# Altium project First_plate_pic.PrjPcb
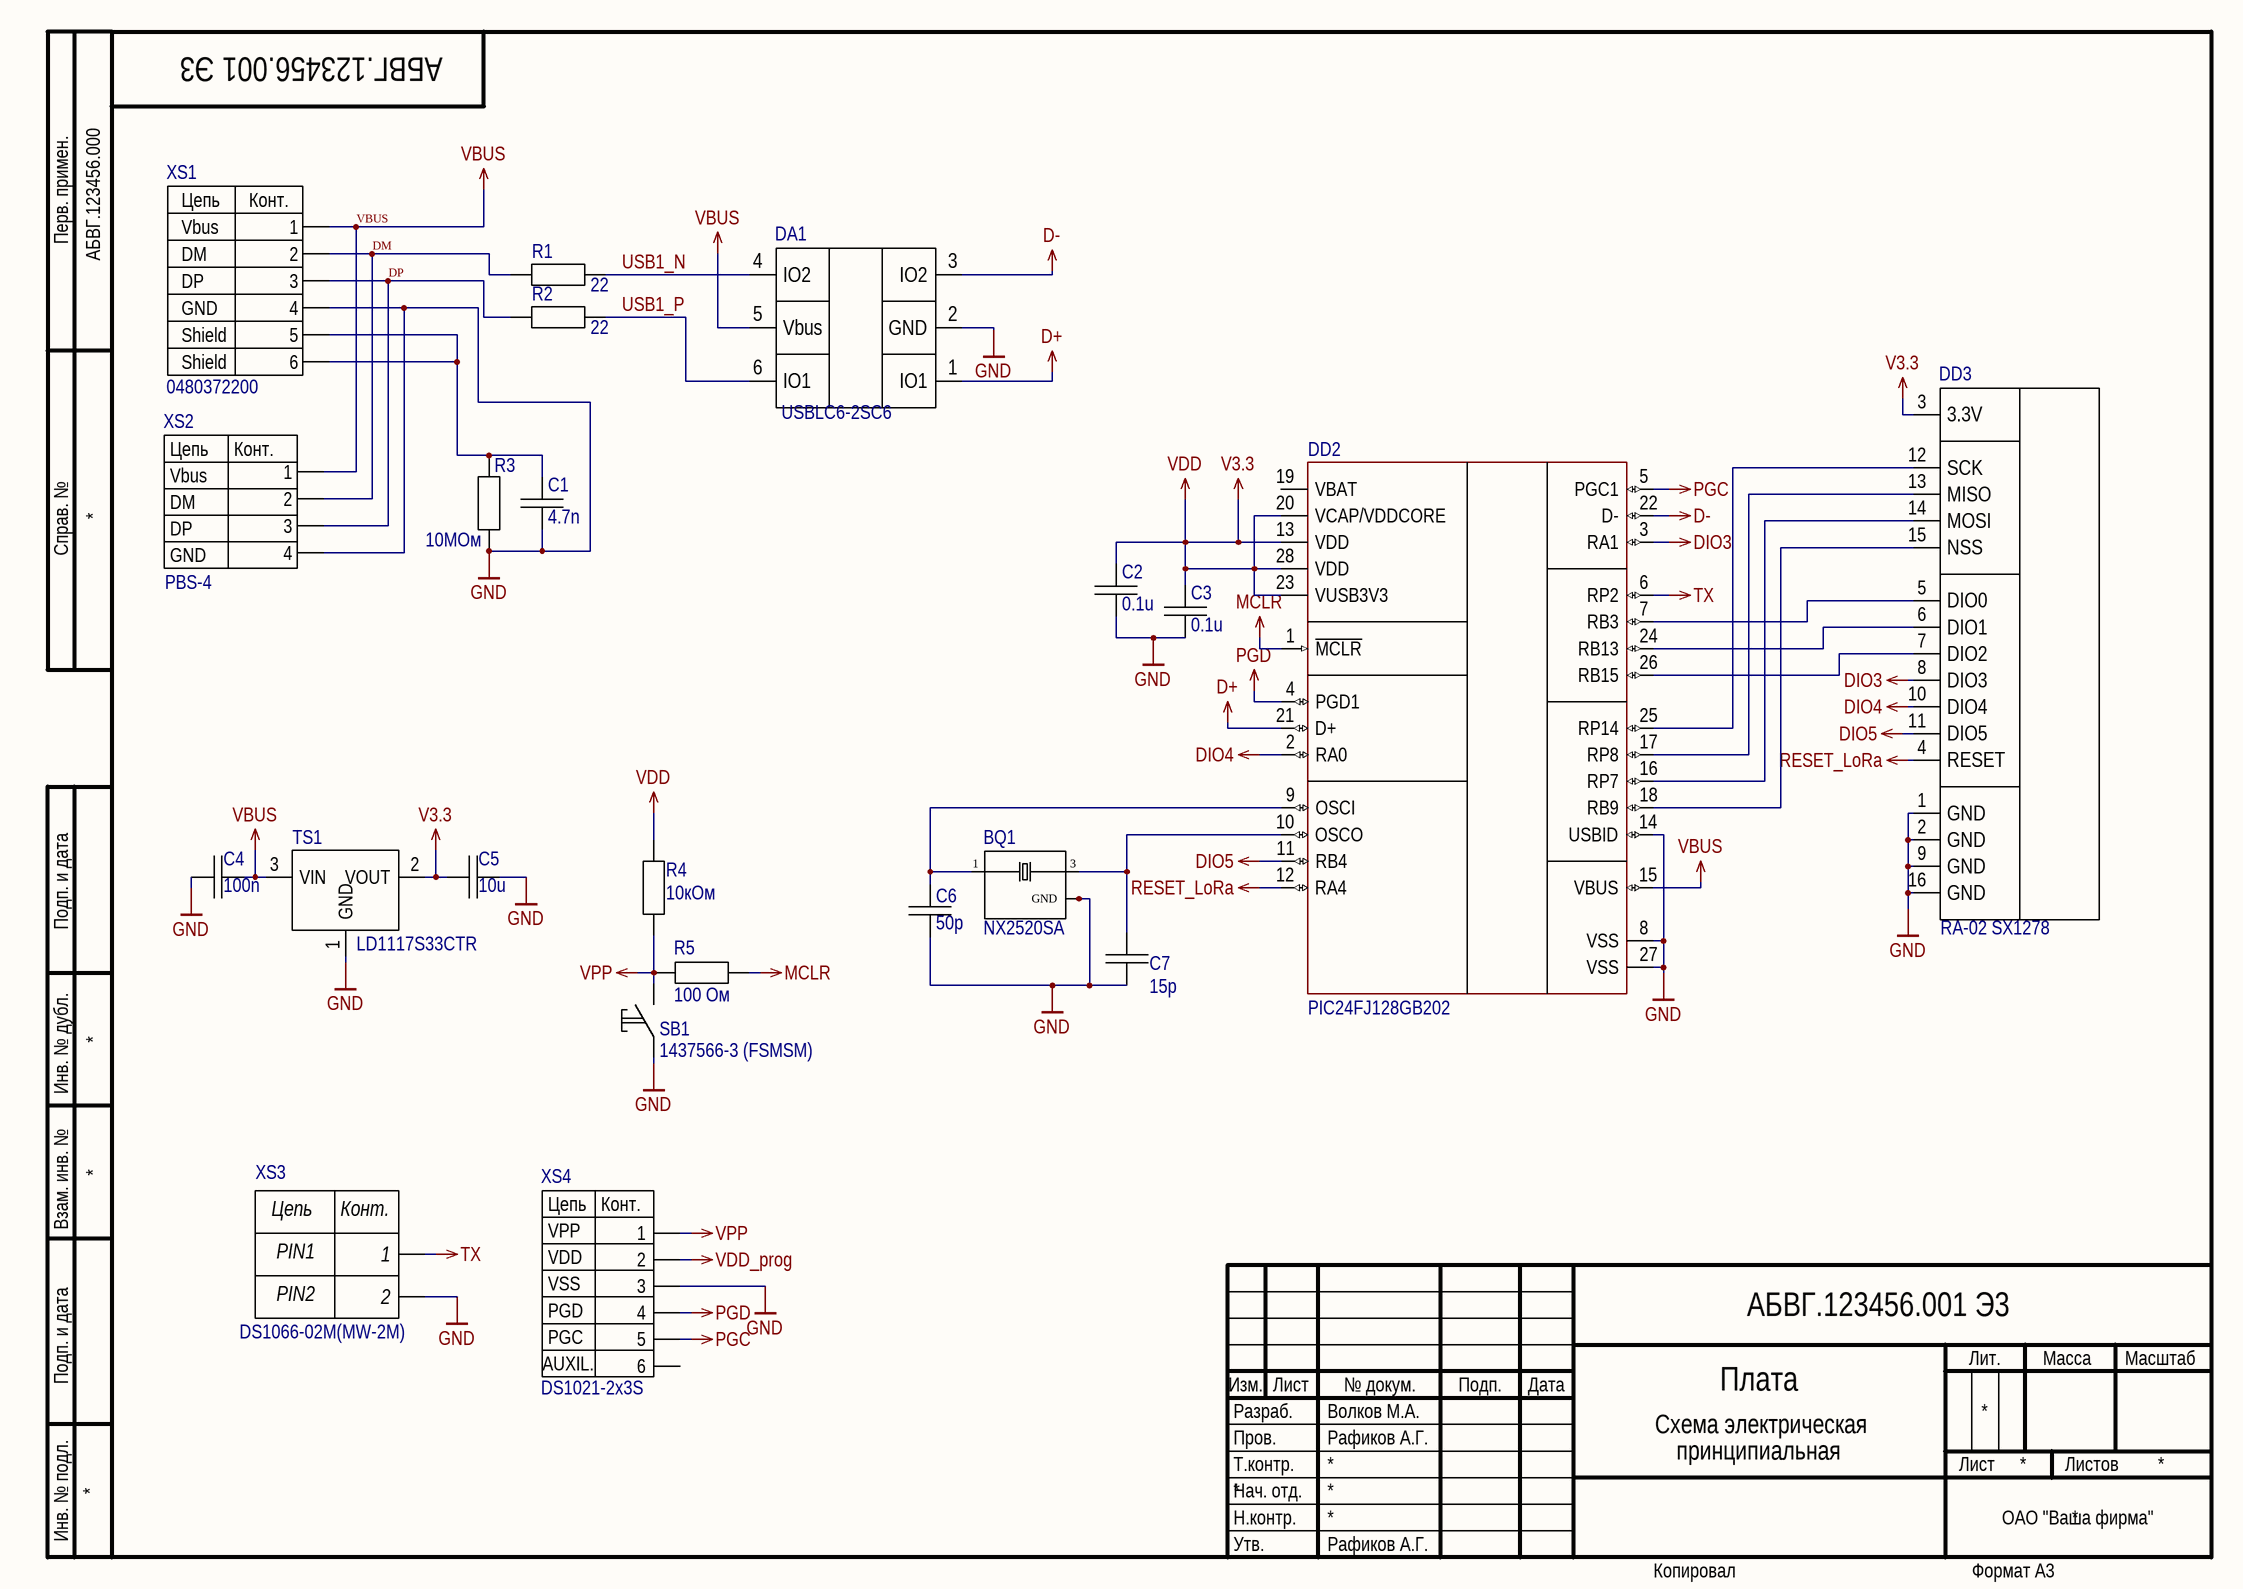
[diagram p0: LoraPic.SchDoc]
1 sheet, 22 parts. Net scope: global (net labels, ports and power ports of the same name join across sheets).
Board file: LoRaPIC1.PcbDoc

## Sheet LoraPic.SchDoc
size 420 x 297 mm; Organization: Altium Limited; Address1: L3, 12a Rodborough Rd; Address2: Frenchs Forest; Address3: NSW; Address4: Australia 2086; Scale: 1:1; Разраб.: Волков М.А.; Обозначение документа: АБВГ.123456.001 Э3; Пров.: Рафиков А.Г.; Утв.: Рафиков А.Г.; Наименование организации: ОАО "Ваша фирма"; Перв. применение: АБВГ.123456.000; Наименование изделия 1: Плата; Наименование изделия 2: Схема электрическая; Наименование изделия 3: принципиальная; Нач. отд.: Нач. отд.

### Parts
BQ1  NX2520SA  [*XTAL_NX2520SA-24.000000MHZ-B8]
C1  value 4.7n  [CAPC1608X09L]  (hidden comment: GRM1887U1H472JA01D)
C2  GRM21BR71C105KA01L: 0.1u  [CAPC1608X09L]  (hidden comment: GRM188R71H104KA93D)
C3  GRM21BR71C105KA01L: 0.1u  [CAPC1608X09L]  (hidden comment: GRM188R71H104KA93D)
C4  GRM21BR71C105KA01L: 100n  [CAPC1608X09L]  (hidden comment: GRM188R71H104KA93D)
C5  GRM21BR71C105KA01L: 10u  [CAPC1608X09L]  (hidden comment: GRM188R61E106MA73D)
C6  GRM21BR71C105KA01L: 50p  [CAPC1608X09L]  (hidden comment: GRM1885C1H510JA01D)
C7  GRM21BR71C105KA01L: 15p  [CAPC1608X09L]  (hidden comment: GRM1885C2A150JA01D)
DA1  USBLC6-2SC6  [SOT95P280X145-6N]
DD2  PIC24FJ128GB202-I-SO  [Microchip_SO-28_0]  (value not drawn)
DD3  RA-02 SX1278  [RA-02]
R1  value 22  [RESC1608X05N]  (hidden comment: RC0603FR-0768RL)
R2  value 22  [RESC1608X05N]  (hidden comment: RC0603FR-0768RL)
R3  value 10МОм  [RESC1608X05N]  (hidden comment: RC0603FR-0710KL)
R4  value 10кОм  [RESC1608X05N]  (hidden comment: RC0603FR-0710KL)
R5  value 100 Ом  [RESC1608X05N]  (hidden comment: 100 ом до 470)
SB1  1437566-3 (FSMSM)  [*SW_1437566-4]
TS1  LD1117S33CTR  [*SOT223]
XS1  Part Number: 0480372200  [Molex_0480372200_0]  (hidden comment: Conn_Molex_0480372200_eec)
XS2  PBS-4  [PBS-4]
XS3  DS1066-02M(MW-2M)  [B2B-XH-A]
XS4  DS1021-2x3S  [DS1021-2x3S]

### Nets
D+: DA1.1(IO1) DD2.21(D+)
D-: DA1.3(IO2) DD2.22(D-)
DIO3: DD2.3(RA1) DD3.8(DIO3)
DIO4: DD2.2(RA0) DD3.10(DIO4)
DIO5: DD2.11(RB4) DD3.11(DIO5)
GND: BQ1.2(GND) BQ1.4(GND) C1.1 C2.2 C3.2 C4.2 C5.1 C6.2 C7.2 DA1.2(GND) DD2.8(VSS) DD2.14(USBID) DD2.27(VSS) DD3.1(GND) DD3.2(GND) DD3.9(GND) DD3.16(GND) R3.2 SB1.1 TS1.1(GND) XS1.4 XS2.4 XS3.2 XS4.3
MCLR: DD2.1(~{MCLR}) R5.1
PGC: DD2.5(PGC1) XS4.5
PGD: DD2.4(PGD1) XS4.4
RESET_LoRa: DD2.12(RA4) DD3.4(RESET)
TX: DD2.6(RP2) XS3.1
V3.3: C2.1 C3.1 C5.2 DD2.13(VDD) DD2.20(VCAP/VDDCORE) DD2.23(VUSB3V3) DD2.28(VDD) DD3.3(3.3V) R4.1 TS1.2(VOUT)  [also labelled VDD]
VBUS: C4.1 DA1.5(Vbus) DD2.15(VBUS) TS1.3(VIN) XS1.1 XS2.1
VDD_prog: XS4.2
VPP: R4.2 R5.2 SB1.2 XS4.1
DM: R1.2 XS1.2 XS2.2
DP: R2.2 XS1.3 XS2.3
USB1_N: DA1.4(IO2) R1.1
USB1_P: DA1.6(IO1) R2.1
NetBQ1_1: BQ1.1 C6.1 DD2.9(OSCI)
NetBQ1_3: BQ1.3 C7.1 DD2.10(OSCO)
NetC1_2: C1.2 R3.1 XS1.5(MNT_1) XS1.6(MNT_2)
NetDD2_7: DD2.7(RB3) DD3.5(DIO0)
NetDD2_16: DD2.16(RP7) DD3.14(MOSI)
NetDD2_17: DD2.17(RP8) DD3.13(MISO)
NetDD2_18: DD2.18(RB9) DD3.15(NSS)
NetDD2_24: DD2.24(RB13) DD3.6(DIO1)
NetDD2_25: DD2.25(RP14) DD3.12(SCK)
NetDD2_26: DD2.26(RB15) DD3.7(DIO2)

Not connected (* = marked no-connect by the designer): DD2 19(VBAT); XS4 6

### Notes on the sheet
- Перв. примен.
- Справ. №
- Подп. и дата
- Инв. № дубл.
- Взам. инв. №
- Разраб.
- Изм.
- Лист
- № докум.
- Подп.
- Дата
- Лит.
- Масса
- Масштаб
- Пров.
- Т.контр.
- Листов
- Инв. № подл.
- Утв.
- Н.контр.
- Копировал
- Формат А3
- (in symbol B2B-XH-A) Цепь; Конт.; PIN1; PIN2
- (in symbol Conn_Molex_0480372200_eec) Цепь; Конт.; Vbus; DM; DP; GND; Shield
- (in symbol PBS-4) Цепь; Конт.; Vbus; DM; DP; GND
- (in symbol PIC24FJ128GB202-I-SO) PIC24FJ128GB202
- (in symbol PLD3X2) Цепь; Конт.; VPP; VDD; VSS; PGD; PGC; AUXIL.

### Library data of the parts
BQ1 = NX2520SA-24.000000MHZ-B8: CRYSTAL 24.0000MHZ 10PF SMD; MF: NDK America, Inc.; Package: SMD-4 NDK America, Inc.; MP: NX2520SA-24.000000MHZ-B8; Availability: Unavailable; SnapEDA_Link: https://www.snapeda.com/parts/NX2520SA-24.000000MHZ-B8/NDK%20America%2C%20Inc./view-part/?ref=snap; Price: None; Value: *
C1 = CC1608: Конденсатор 1.6x0.8 мм; Tolerance: ±10%; ТКЕ: X7R; РКД Наименование: CC1608M - NP0 - 16 V - 4.7 nF ±10%; Voltage: *; Type: *; PartNo: *; Supplier Part Number 1: *; Supplier 1: *; ComponentLink1Description: buy; ComponentLink1URL: https://www.chipdip.ru/product/grm1887u1h472ja01d
C2-C6 = CC1608: Конденсатор 1.6x0.8 мм; Tolerance: ±10%; ТКЕ: X7R; РКД Наименование: CC1608M - NP0 - 16 V - 10 nF ±10%; Voltage: *; Type: *; PartNo: *; Supplier Part Number 1: *; Supplier 1: *; ComponentLink1Description: buy
  C2: ComponentLink1URL: https://www.chipdip.ru/product/grm188r71h104khttps://www.chipdip.ru/product/grm188r71h104k
  C3 C4: ComponentLink1URL: https://www.chipdip.ru/product/grm188r71h104k
  C5: ComponentLink1URL: https://www.chipdip.ru/product/grm188r61e106m
  C6: ComponentLink1URL: https://www.chipdip.ru/product/grm1885c1h510j
C7 = CC1608: Конденсатор 0.8x0.5 мм 50 пикофара; Tolerance: ±10%; ТКЕ: X7R; РКД Наименование: CC1608M - NP0 - 16 V - 10 nF ±10%; Voltage: *; Type: *; PartNo: *; Supplier Part Number 1: *; Supplier 1: *; ComponentLink1Description: buy; ComponentLink1URL: https://www.chipdip.ru/product/grm1885c2a150j
DA1 = USBLC6-2SC6: USB protection IC; Manufacturer: STMicroelectronics; Direction: Bidirectional,Unidirectional; Capacitance: 3.5pF; Clamping Voltage: 17V; Operating Supply Voltage: 1.1V; Number of Channels: 2; Breakdown Voltage: 6V; Reverse Standoff Voltage: 5.25V; Power Line Protection: Yes; Test Current: 1mA; Max Reverse Leakage Current: 150nA; Peak Pulse Current: 5A; Element Configuration: Dual; Data Rate: 480Mbps; Number of Elements: 1; Working Voltage: 5V; PartNo: USBLC6-2SC6; Supplier 1: Digi-Key; Manufacturer Part Number: USBLC6-2SC6; Stock 1: 165611; Pricing 1: 1=0.49, 10=0.419, 100=0.3131, 500=0.24602, 1000=0.1901 (USD); Mount: Surface Mount; Case/Package: SOT-23; Number of Pins: 6; Contact Plating: Matte,Tin; Min Operating Temperature: -40°C; Max Operating Temperature: 125°C; Packaging: Tape and Reel; Package Quantity: 3000; Termination: SMD/SMT; Number of Bidirectional Channels: 2; Min Breakdown Voltage: 6V; ESD Protection: Yes; Leakage Current: 150nA; Reverse Breakdown Voltage: 6V; Polarity: Bidirectional,Unidirectional; Max Breakdown Voltage: 6V; Length: 3.05mm; Height: 1.3mm; Width: 1.75mm; Depth: 1.75mm; Radiation Hardening: No; REACH SVHC: No SVHC; Lead Free: Lead Free; ComponentLink1URL: http://www.farnell.com/datasheets/1690354.pdf; ComponentLink1Description: http://www.farnell.com/datasheets/1690354.pdf; ComponentLink2URL: http://www.st.com/content/ccc/resource/technical/document/datasheet/06/1d/48/9c/6c/20/4a/b2/CD00050750.pdf/files/CD00050750.pdf/jcr:content/translations/en.CD00050750.pdf; ComponentLink2Description: http://www.st.com/content/ccc/resource/technical/document/datasheet/06/1d/48/9c/6c/20/4a/b2/CD00050750.pdf/files/CD00050750.pdf/jcr:content/translations/en.CD00050750.pdf; ComponentLink3URL: http://www.st.com/web/en/resource/technical/document/datasheet/CD00050750.pdf; ComponentLink3Description: http://www.st.com/web/en/resource/technical/document/datasheet/CD00050750.pdf; ComponentLink4URL: http://datasheet.iiic.cc/stmicroelectronics/USBLC6-2SC6.pdf; ComponentLink4Description: http://datasheet.iiic.cc/stmicroelectronics/USBLC6-2SC6.pdf; ComponentLink5URL: http://www.produktinfo.conrad.com/datenblaetter/1100000-1199999/001184109-da-01-en-IC_ESD_PROTECTI_USBLC6_2SC6_SOT_23_6_STM.pdf; ComponentLink5Description: http://www.produktinfo.conrad.com/datenblaetter/1100000-1199999/001184109-da-01-en-IC_ESD_PROTECTI_USBLC6_2SC6_SOT_23_6_STM.pdf; Supplier Part Number 1: 497-5235-1-ND
DD3 = RA-02
R1 R2 = R1608: Резистор 1.6x0.8 мм; Tolerance: ±1%; РКД Наименование: RC1608M - 22 Ohm ±1%; Type: *; PartNo: *; Supplier 1: *; Supplier Part Number 1: *; ComponentLink1Description: buy; ComponentLink1URL: https://www.chipdip.ru/product0/9000079612
R3-R5 = R1608: Резистор 1.6x0.8 мм; Tolerance: ±5%; РКД Наименование: RC1608M - 100 Ohm ±5%; Type: *; PartNo: *; Supplier 1: *; Supplier Part Number 1: *
  R3 R4: ComponentLink1Description: https://www.chipdip.ru/product0/9000079736; ComponentLink1URL: https://www.chipdip.ru/product0/9000079736
  R5: ComponentLink1Description: https://www.chipdip.ru/product0/9000079616; ComponentLink1URL: https://www.chipdip.ru/product0/9000079616
SB1 = FSMSM: 1437566-3 (FSMSM), Кнопка тактовая h=4.6 мм SMD SPST Switch Tactile / Switch Tactile OFF (ON) SPST Rectangular Button Gull Wing 0.05A 24VDC SMD Loose; Произвдитель: TE Connectivity; Артикул: 1437566-3 (FSMSM); ComponentLink1Description: buy; ComponentLink1URL: https://www.chipdip.ru/product/tyco-1437566-3-fsmsm; ComponentLink2Description: datasheet; ComponentLink2URL: https://static.chipdip.ru/lib/071/DOC000071159.pdf
TS1 = LD1117S33CTR: Linear Regulator / LDO Regulator Pos 3.3V 1.3A 4-Pin(3+Tab) SOT-223 T/R; Code_IPC: SOT-223; PackageVersion: revBB, Aug-2009; PackageReference: SOT-223; PackageDescription: 3-Lead Plastic Small Outline Transistor (TT) [SOT-23]; DatasheetVersion: revB, Feb-2007; PartNumber: LD1117S33CTR; ComponentLink1Description: buy; ComponentLink1URL: https://www.chipdip.ru/product/ld1117s33ctr-2; ComponentLink2Description: datasheet; ComponentLink2URL: https://static.chipdip.ru/lib/292/DOC000292513.pdf
XS1 = Conn_Molex_0480372200_eec: CONN PLUG USB A 4POS SMD R/A; Manufacturer: Molex; Is Female: yes; Current - Maximum per Contact: 1.5A; Voltage - Maximum: 150V AC (RMS); helpURL: https://upverter.com/upn/revision/6bade1e906f93a88/; ComponentLink2Description: Datasheet; Temperature: -20°C to +85°C; Package: CONN_USB_12MM0_18MM75; Supplier 2: Mouser; Price: 0.972849437621; Supplier 1: Digi-Key; ComponentLink1URL: https://upverter.com/upn/revision/6bade1e906f93a88/; Supplier Part Number 2: 538-48037-2200; Supplier Part Number 1: WM3983CT-ND; ComponentLink1Description: Upverter; ComponentLink2URL: http://www.molex.com/pdm_docs/sd/480372200_sd.pdf; RoHS: TRUE; Mouser Part Number: 538-48037-2200; Temperature Range High: +85°C; Digikey Description: CONN PLUG USB A 4POS SMD R/A; Digikey Part Number: WM3983CT-ND; Lead Free: yes; Temperature Range Low: -20°C
XS2 = PBS-4: 2.54mm; ComponentLink1Description: 3d; ComponentLink1URL: https://www.3dcontentcentral.com/secure/download-model.aspx?catalogid=171&id=455493; ComponentLink2Description: https://www.chipdip.ru/product/pld-6; ComponentLink2URL: https://www.chipdip.ru/product/pld-6
XS3 = B2B-XH-A: Разъем 2; Manufacturer: JST; Manufacturer Part Number: B2B-XH-A(LF)(SN); Number of Positions: 2; Connector Type: Male Pin; Contact Resistance: 20mR; Max Current Rating: 3A; Max Voltage Rating (AC): 250V; Insulation Resistance: 1GR; Pitch: 2.5mm; Wire/Cable Gauge: 22AWG; Supplier 1: Digi-Key; Stock 1: 494280; Pricing 1: 1=0.15, 10=0.141, 100=0.0868, 500=0.07182, 1000=0.06284, 5000=0.05387, 10000=0.05237 (USD); Mount: Through Hole; Contact Plating: Copper,Lead,Tin; Colour: Natural; Contact Material: Brass; Housing Material: Polyamide; Housing Colour: White; Min Operating Temperature: -25°C; Max Operating Temperature: 85°C; Termination: Solder; Number of Rows: 1; Packaging: Bulk; Fastening Type: Detent; Orientation: Straight; Current Rating: 3A; Voltage Rating: 250V; Voltage Rating (AC): 250V; Number of Contacts: 2; Max Voltage Rating (DC): 250V; Length: 7.4mm; Depth: 5.75mm; Lead Pitch: 2.5mm; Lead Free: Lead Free; REACH SVHC: No SVHC; Supplier Part Number 1: 455-2247-ND; РКД Наименование: *
XS4 = PLD3X2: ComponentLink1Description: Datasheet; ComponentLink1URL: https://static.chipdip.ru/lib/227/DOC000227157.pdf; ComponentLink2Description: footprint; ComponentLink2URL: https://www.3dcontentcentral.com/secure/download-model.aspx?catalogid=171&id=227431